# EAGLE design main_board (EAGLE 7.0.0)
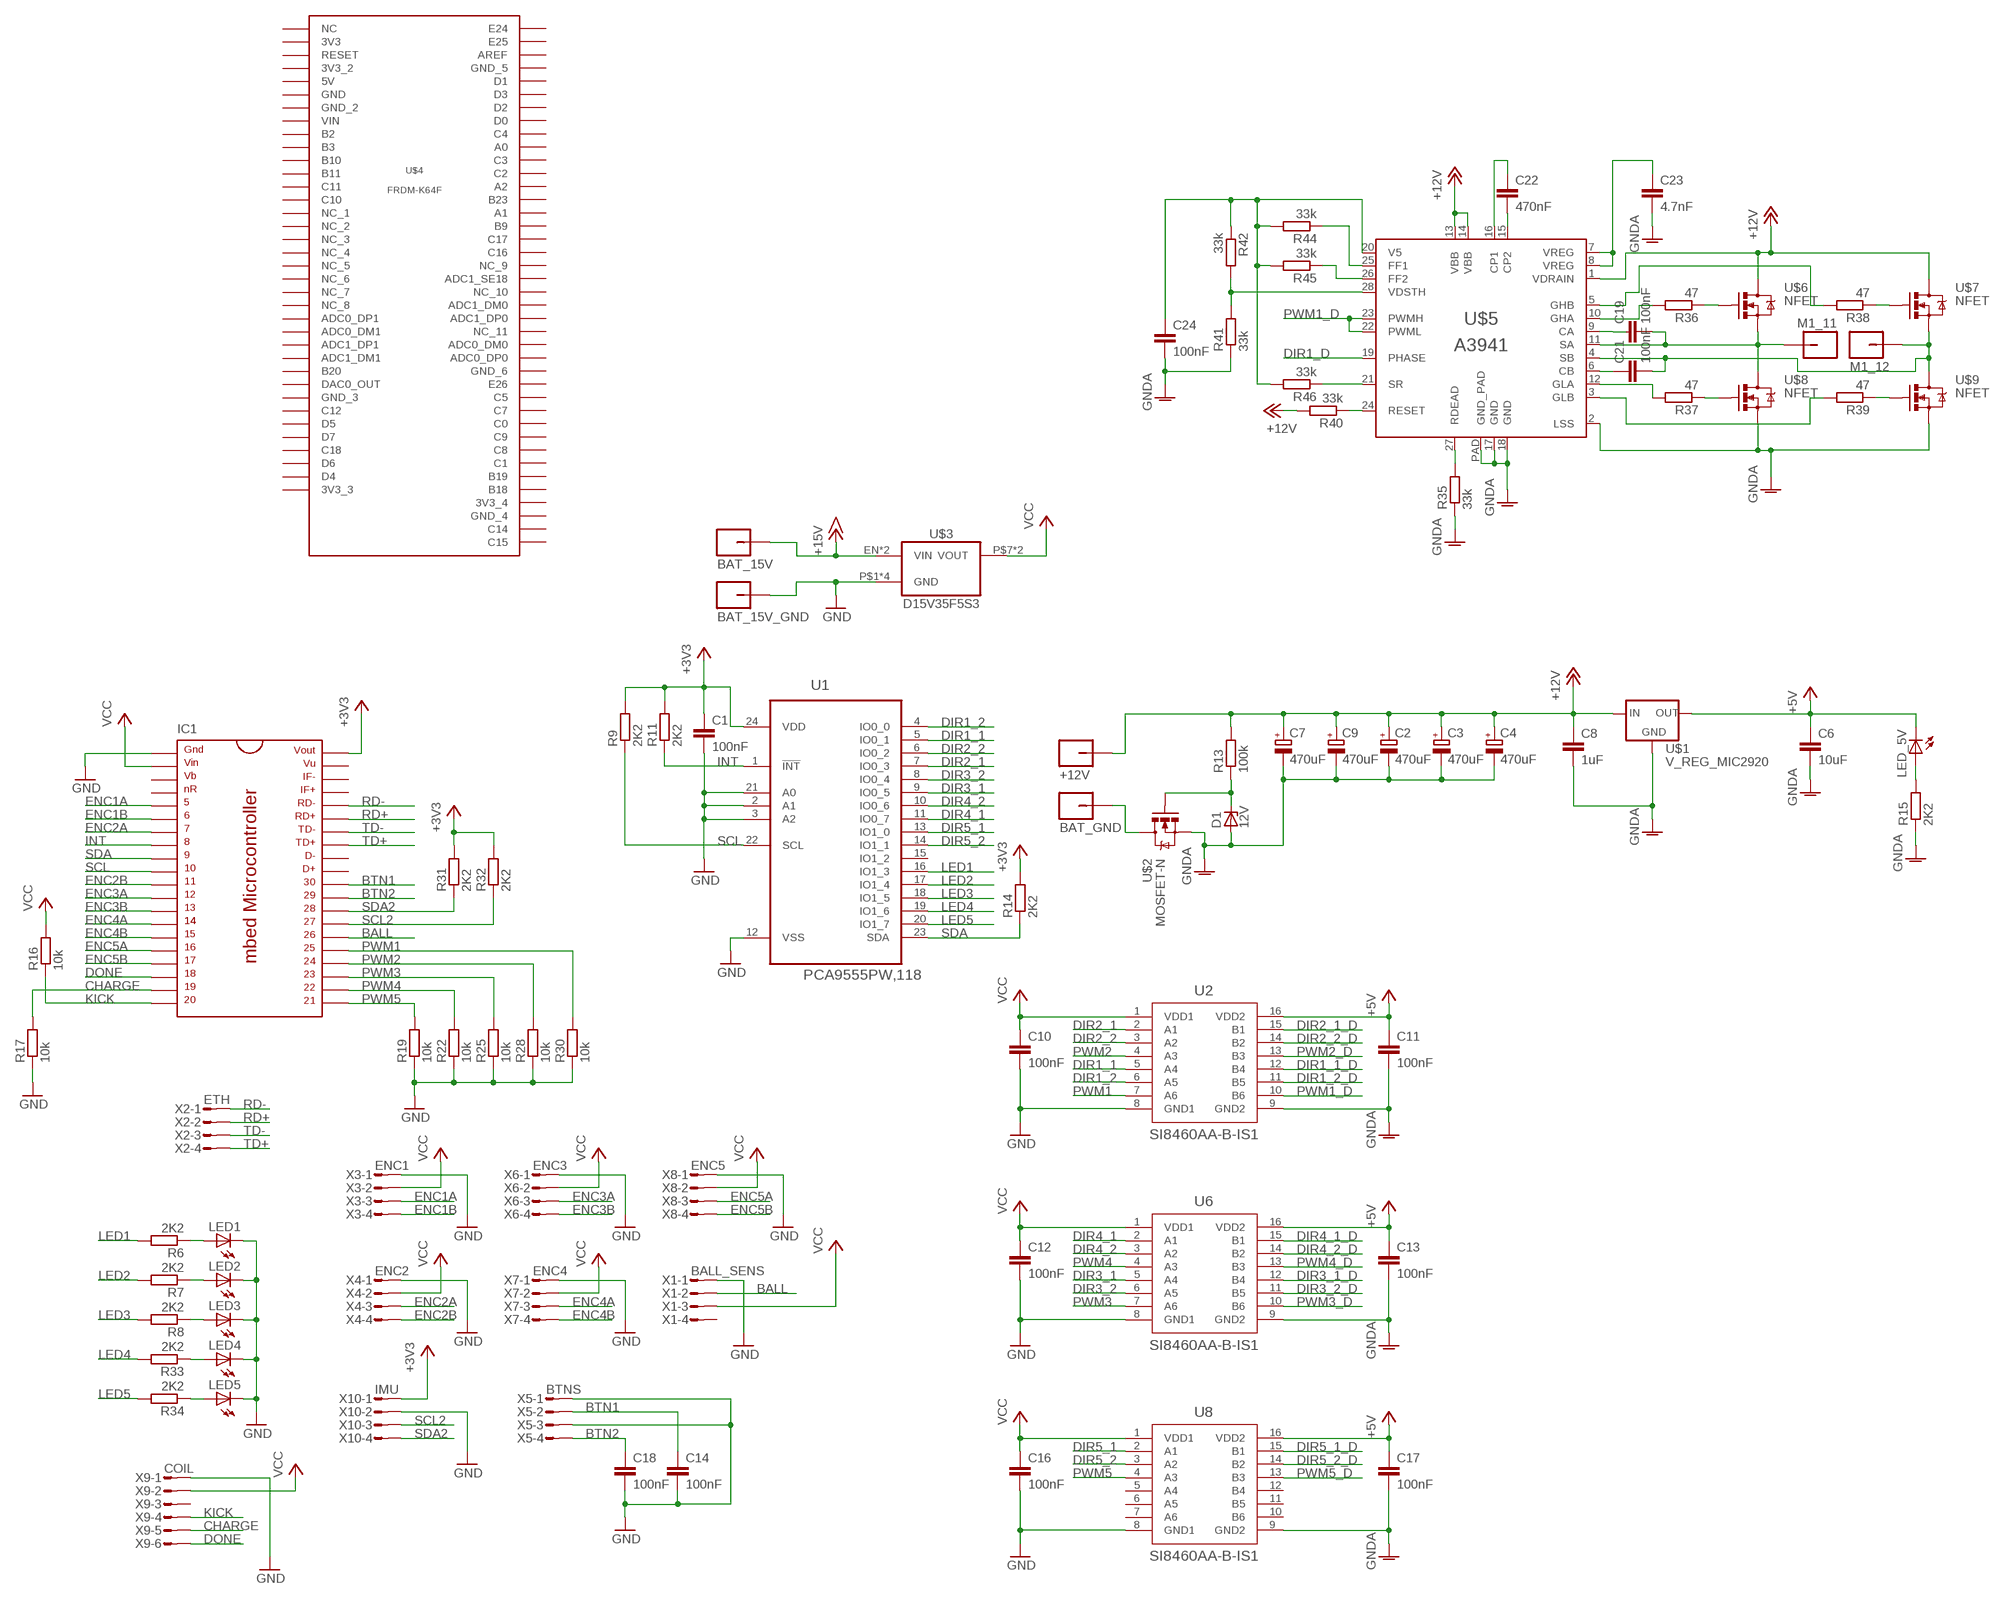
[diagram p0: schematic, sheet 1]

## Parts
+12V  M01_PWR  [PWR_HOLE]
BAT_15V  M01_WIRE  [WIRE_HOLE]
BAT_15V_GND  M01_WIRE  [WIRE_HOLE]
BAT_GND  M01_PWR  [PWR_HOLE]
C1  100nF  C-EUC0603K  [C0603K]
C2  470uF  CPOL-EUE3.5-8  [E3,5-8]
C3  470uF  CPOL-EUE3.5-8  [E3,5-8]
C4  470uF  CPOL-EUE3.5-8  [E3,5-8]
C6  10uF  C-EUC1206K  [C1206K]
C7  470uF  CPOL-EUE3.5-8  [E3,5-8]
C8  1uF  C-EUC0603K  [C0603K]
C9  470uF  CPOL-EUE3.5-8  [E3,5-8]
C10  100nF  C-EUC0603K  [C0603K]
C11  100nF  C-EUC0603K  [C0603K]
C12  100nF  C-EUC0603K  [C0603K]
C13  100nF  C-EUC0603K  [C0603K]
C14  100nF  C-EUC0603K  [C0603K]
C16  100nF  C-EUC0603K  [C0603K]
C17  100nF  C-EUC0603K  [C0603K]
C18  100nF  C-EUC0603K  [C0603K]
C19  100nF  C-EUC0603K  [C0603K]
C21  100nF  C-EUC0603K  [C0603K]
C22  470nF  C-EUC1206K  [C1206K]
C23  4.7nF  C-EUC1206K  [C1206K]
C24  100nF  C-EUC0603K  [C0603K]
D1  12V  ZENER-DIODESOD123  [SOD123]
IC1  MBED_MICROCONTROLLER  [DIL40_0.9]
LED1  LEDCHIP-LED0603  [CHIP-LED0603]
LED2  LEDCHIP-LED0603  [CHIP-LED0603]
LED3  LEDCHIP-LED0603  [CHIP-LED0603]
LED4  LEDCHIP-LED0603  [CHIP-LED0603]
LED5  LEDCHIP-LED0603  [CHIP-LED0603]
LED_5V  LEDCHIP-LED0603  [CHIP-LED0603]
M1_11  M01_WIRE  [WIRE_HOLE]
M1_12  M01_WIRE  [WIRE_HOLE]
R6  2K2  R-EU_R0603  [R0603]
R7  2K2  R-EU_R0603  [R0603]
R8  2K2  R-EU_R0603  [R0603]
R9  2K2  R-EU_R0603  [R0603]
R11  2K2  R-EU_R0603  [R0603]
R13  100k  R-EU_R0603  [R0603]
R14  2K2  R-EU_R0603  [R0603]
R15  2K2  R-EU_R0603  [R0603]
R16  10k  R-EU_R0603  [R0603]
R17  10k  R-EU_R0603  [R0603]
R19  10k  R-EU_R0603  [R0603]
R22  10k  R-EU_R0603  [R0603]
R25  10k  R-EU_R0603  [R0603]
R28  10k  R-EU_R0603  [R0603]
R30  10k  R-EU_R0603  [R0603]
R31  2K2  R-EU_R0603  [R0603]
R32  2K2  R-EU_R0603  [R0603]
R33  2K2  R-EU_R0603  [R0603]
R34  2K2  R-EU_R0603  [R0603]
R35  33k  R-EU_R0603  [R0603]
R36  47  R-EU_R0603  [R0603]
R37  47  R-EU_R0603  [R0603]
R38  47  R-EU_R0603  [R0603]
R39  47  R-EU_R0603  [R0603]
R40  33k  R-EU_R0603  [R0603]
R41  33k  R-EU_R0603  [R0603]
R42  33k  R-EU_R0603  [R0603]
R44  33k  R-EU_R0603  [R0603]
R45  33k  R-EU_R0603  [R0603]
R46  33k  R-EU_R0603  [R0603]
U1  PCA9555PW,118  [SOP65P640X110-24N]
U2  SI8460AA-B-IS1  [SOIC-16]
U6  SI8460AA-B-IS1  [SOIC-16]
U8  SI8460AA-B-IS1  [SOIC-16]
U$1  V_REG_MIC2920  [SOT223]
U$2  MOSFET-N  MOSFET-N-SOT669  [TO127P600X120-5N]
U$3  D15V35F5S3  [D15V35F5S3]
U$4  FRDM-K64F  [FRDM-K64F]
U$5  A3941  [A3941]
U$6  NFET  MOSFET-N-SOT669  [TO127P600X120-5N]
U$7  NFET  MOSFET-N-SOT669  [TO127P600X120-5N]
U$8  NFET  MOSFET-N-SOT669  [TO127P600X120-5N]
U$9  NFET  MOSFET-N-SOT669  [TO127P600X120-5N]
X1  BALL_SENS  MICROMATCH-4  [MICROMATCH-4]
X2  ETH  MICROMATCH-4  [MICROMATCH-4]
X3  ENC1  MICROMATCH-4  [MICROMATCH-4]
X4  ENC2  MICROMATCH-4  [MICROMATCH-4]
X5  BTNS  MICROMATCH-4  [MICROMATCH-4]
X6  ENC3  MICROMATCH-4  [MICROMATCH-4]
X7  ENC4  MICROMATCH-4  [MICROMATCH-4]
X8  ENC5  MICROMATCH-4  [MICROMATCH-4]
X9  COIL  MICROMATCH-6  [MICROMATCH-6]
X10  IMU  MICROMATCH-4  [MICROMATCH-4]

## Nets
+3V3: C1.1 IC1.40 R9.2 R11.2 R14.2 R31.2 R32.2 U1.24(VDD) X10.1
+5V: C6.1 C11.1 C13.1 C17.1 LED_5V.C U2.16(VDD2) U6.16(VDD2) U8.16(VDD2) U$1.3(OUT)
+12V: +12V.P$1 C2.+ C3.+ C4.+ C7.+ C8.1 C9.+ R13.2 R40.2 U$1.1(IN) U$5.1(VDRAIN) U$5.13(VBB) U$5.14(VBB) U$6.5(D) U$7.5(D)
+15V: BAT_15V.P$1 U$3.EN(VIN) U$3.P$5(VIN)
BALL: IC1.26 X1.2
BTN1: C14.1 IC1.30 X5.2
BTN2: C18.1 IC1.29 X5.4
CHARGE: IC1.19 R17.2 X9.5
DIR1_1: U1.5(IO0_1) U2.5(A4)
DIR1_1_D: U2.12(B4)
DIR1_2: U1.4(IO0_0) U2.6(A5)
DIR1_2_D: U2.11(B5)
DIR1_D: U$5.19(PHASE)
DIR2_1: U1.7(IO0_3) U2.2(A1)
DIR2_1_D: U2.15(B1)
DIR2_2: U1.6(IO0_2) U2.3(A2)
DIR2_2_D: U2.14(B2)
DIR3_1: U1.9(IO0_5) U6.5(A4)
DIR3_1_D: U6.12(B4)
DIR3_2: U1.8(IO0_4) U6.6(A5)
DIR3_2_D: U6.11(B5)
DIR4_1: U1.11(IO0_7) U6.2(A1)
DIR4_1_D: U6.15(B1)
DIR4_2: U1.10(IO0_6) U6.3(A2)
DIR4_2_D: U6.14(B2)
DIR5_1: U1.13(IO1_0) U8.2(A1)
DIR5_1_D: U8.15(B1)
DIR5_2: U1.14(IO1_1) U8.3(A2)
DIR5_2_D: U8.14(B2)
DONE: IC1.18 X9.6
ENC1A: IC1.5 X3.3
ENC1B: IC1.6 X3.4
ENC2A: IC1.7 X4.3
ENC2B: IC1.11 X4.4
ENC3A: IC1.12 X6.3
ENC3B: IC1.13 X6.4
ENC4A: IC1.14 X7.3
ENC4B: IC1.15 X7.4
ENC5A: IC1.16 X8.3
ENC5B: IC1.17 X8.4
GND: BAT_15V_GND.P$1 C1.2 C10.2 C12.2 C14.2 C16.2 C18.2 IC1.1 LED1.C LED2.C LED3.C LED4.C LED5.C R17.1 R19.1 R22.1 R25.1 R28.1 R30.1 U1.2(A1) U1.3(A2) U1.12(VSS) U1.21(A0) U2.8(GND1) U6.8(GND1) U8.8(GND1) U$3.P$1(GND) U$3.P$2(GND) U$3.P$3(GND) U$3.P$4(GND) X1.1 X3.1 X4.1 X5.1 X5.3 X6.1 X7.1 X8.1 X9.1 X10.2
GNDA: C2.- C3.- C4.- C6.2 C7.- C8.2 C9.- C11.2 C13.2 C17.2 C23.2 C24.2 D1.A R15.1 R35.1 R41.1 U2.9(GND2) U6.9(GND2) U8.9(GND2) U$1.2(GND) U$1.4(GND) U$2.1(S) U$2.2(S) U$2.3(S) U$5.2(LSS) U$5.17(GND) U$5.18(GND) U$5.PAD(GND_PAD) U$8.1(S) U$8.2(S) U$8.3(S) U$9.1(S) U$9.2(S) U$9.3(S)
INT: IC1.8 R11.1 U1.1(!INT)
KICK: IC1.20 R16.1 X9.4
LED1: R6.2 U1.16(IO1_3)
LED2: R7.2 U1.17(IO1_4)
LED3: R8.2 U1.18(IO1_5)
LED4: R33.2 U1.19(IO1_6)
LED5: R34.2 U1.20(IO1_7)
N$7: LED1.A R6.1
N$8: LED2.A R7.1
N$9: LED3.A R8.1
N$10: LED_5V.A R15.2
N$11: LED4.A R33.1
N$12: LED5.A R34.1
N$13: R37.1 U$8.4(G)
N$14: R38.1 U$7.4(G)
N$16: R39.1 U$9.4(G)
N$17: R36.1 U$6.4(G)
N$19: C21.1 U$5.6(CB)
N$20: D1.C R13.1 U$2.4(G)
N$21: BAT_GND.P$1 U$2.5(D)
N$22: C19.2 M1_11.P$1 U$5.11(SA) U$6.1(S) U$6.2(S) U$6.3(S) U$8.5(D)
N$24: C21.2 M1_12.P$1 U$5.4(SB) U$7.1(S) U$7.2(S) U$7.3(S) U$9.5(D)
N$26: C19.1 U$5.9(CA)
N$27: R35.2 U$5.27(RDEAD)
N$28: R36.2 U$5.10(GHA)
N$29: R38.2 U$5.5(GHB)
N$30: R37.2 U$5.12(GLA)
N$32: R39.2 U$5.3(GLB)
N$37: C22.1 U$5.16(CP1)
N$42: C22.2 U$5.15(CP2)
N$47: C23.1 U$5.7(VREG) U$5.8(VREG)
N$51: R41.2 R42.2 U$5.28(VDSTH)
N$52: C24.1 R42.1 R44.2 R45.2 R46.2 U$5.20(V5)
N$53: R45.1 U$5.26(FF2)
N$54: R40.1 U$5.24(RESET)
N$55: R44.1 U$5.25(FF1)
N$59: R46.1 U$5.21(SR)
PWM1: IC1.25 R30.2 U2.7(A6)
PWM1_D: U2.10(B6) U$5.22(PWML) U$5.23(PWMH)
PWM2: IC1.24 R28.2 U2.4(A3)
PWM2_D: U2.13(B3)
PWM3: IC1.23 R25.2 U6.7(A6)
PWM3_D: U6.10(B6)
PWM4: IC1.22 R22.2 U6.4(A3)
PWM4_D: U6.13(B3)
PWM5: IC1.21 R19.2 U8.4(A3)
PWM5_D: U8.13(B3)
RD+: IC1.35 X2.2
RD-: IC1.36 X2.1
SCL: IC1.10 R9.1 U1.22(SCL)
SCL2: IC1.27 R32.1 X10.3
SDA: IC1.9 R14.1 U1.23(SDA)
SDA2: IC1.28 R31.1 X10.4
TD+: IC1.33 X2.4
TD-: IC1.34 X2.3
VCC: C10.1 C12.1 C16.1 IC1.2 R16.2 U2.1(VDD1) U6.1(VDD1) U8.1(VDD1) U$3.P$7(VOUT) U$3.P$8(VOUT) X1.3 X3.2 X4.2 X6.2 X7.2 X8.2 X9.2
Unconnected: IC1.3 IC1.4 IC1.31 IC1.32 IC1.37 IC1.38 IC1.39 U1.15(IO1_2) U8.5(A4) U8.6(A5) U8.7(A6) U8.10(B6) U8.11(B5) U8.12(B4) U$4.A0 U$4.A1 U$4.A3(A2) U$4.ADC0_DM0 U$4.ADC0_DM1 U$4.ADC0_DP0 U$4.ADC0_DP1 U$4.ADC1_DM0 U$4.ADC1_DM1 U$4.ADC1_DP0 U$4.ADC1_DP1 U$4.ADC1_SE18 U$4.AREF U$4.B2 U$4.B3 U$4.B9 U$4.B10 U$4.B11 U$4.B18 U$4.B19 U$4.B20 U$4.B23 U$4.C0 U$4.C1 U$4.C2 U$4.C3 U$4.C4 U$4.C5 U$4.C7 U$4.C8 U$4.C9 U$4.C10 U$4.C11 U$4.C12 U$4.C14 U$4.C15 U$4.C16 U$4.C17 U$4.C18 U$4.D0 U$4.D1 U$4.D2 U$4.D3 U$4.D4 U$4.D5 U$4.D6 U$4.D7 U$4.DAC0_OUT U$4.E24 U$4.E25 U$4.E26 U$4.NC U$4.NC_1 U$4.NC_2 U$4.NC_3 U$4.NC_4 U$4.NC_5 U$4.NC_6 U$4.NC_7 U$4.NC_8 U$4.NC_9 U$4.NC_10 U$4.NC_11 U$4.RESET X1.4 X9.3

## Power pins joined to a net without a drawn wire
3V3: U$4.3V3
3V3_2: U$4.3V3_2
3V3_3: U$4.3V3_3
3V3_4: U$4.3V3_4
5V: U$4.5V
GND: U$4.GND
GND_2: U$4.GND_2
GND_3: U$4.GND_3
GND_4: U$4.GND_4
GND_5: U$4.GND_5
GND_6: U$4.GND_6
VIN: U$4.VIN

## Library data of the parts
+12V BAT_GND = tellis2:M01_PWR
BAT_15V BAT_15V_GND M1_11 M1_12 = tellis2:M01_WIRE
C1 C6 C8 C10-C14 C16-C19 C21-C24 = rcl:C-EU: CAPACITOR, European symbol
C2-C4 C7 C9 = rcl:CPOL-EU: POLARIZED CAPACITOR, European symbol
D1 = diode:ZENER-DIODE: Z-Diode
IC1 = mbed-microcontroller:MBED_MICROCONTROLLER: mbed Microcontroller, DIP40, 0.9"
LED1-LED5 LED_5V = led:LED: LED OSRAM: - CHIPLED LG R971, LG N971, LY N971, LG Q971, LY Q971, LO R971, LY R971 LH N974, LH R974 LS Q976, LO Q976, LY Q976 LO Q996 - Hyper CHIPLED LW Q18S LB Q993, LB Q99A, LB R99A - SideLED LS A670, LO A670, LY A670, LG A670, LP A670 LB A673, LV A673, LT A673, LW A673 LH A674 LY A675 LS A676, LA A676, LO A676, LY A676, LW A676 LS A679, LY A679, LG A679 - Hyper Micro SIDELED® LS Y876, LA Y876, LO Y876, LY Y876 LT Y87S - SmartLED LW L88C, LW L88S LB L89C, LB L89S, LG L890 LS L89K, LO L89K, LY L89K LS L896, LA L896, LO L896, LY L896 - TOPLED LS T670, LO T670, LY T670, LG T670, LP T670 LSG T670, LSP T670, LSY T670, LOP T670, LYG T670 LG T671, LOG T671, LSG T671 LB T673, LV T673, LT T673, LW T673 LH T674 LS T676, LA T676, LO T676, LY T676, LB T676, LH T676, LSB T676, LW T676 LB T67C, LV T67C, LT T67C, LS T67K, LO T67K, LY T67K, LW E67C LS E67B, LA E67B, LO E67B, LY E67B, LB E67C, LV E67C, LT E67C LW T67C LS T679, LY T679, LG T679 LS T770, LO T770, LY T770, LG T770, LP T770 LB T773, LV T773, LT T773, LW T773 LH T774 LS E675, LA E675, LY E675, LS T675 LS T776, LA T776, LO T776, LY T776, LB T776 LHGB T686 LT T68C, LB T68C - Hyper Mini TOPLED® LB M676 - Mini TOPLED Santana® LG M470 LS M47K, LO M47K, LY M47K Source: http://www.osram.convergy.de LUXEON: - LUMILED® LXK2-PW12-R00, LXK2-PW12-S00, LXK2-PW14-U00, LXK2-PW14-V00 LXK2-PM12-R00, LXK2-PM12-S00, LXK2-PM14-U00 LXK2-PE12-Q00, LXK2-PE12-R00, LXK2-PE12-S00, LXK2-PE14-T00, LXK2-PE14-U00 LXK2-PB12-K00, LXK2-PB12-L00, LXK2-PB12-M00, LXK2-PB14-N00, LXK2-PB14-P00, LXK2-PB14-Q00 LXK2-PR12-L00, LXK2-PR12-M00, LXK2-PR14-Q00, LXK2-PR14-R00 LXK2-PD12-Q00, LXK2-PD12-R00, LXK2-PD12-S00 LXK2-PH12-R00, LXK2-PH12-S00 LXK2-PL12-P00, LXK2-PL12-Q00, LXK2-PL12-R00 Source: www.luxeon.com KINGBRIGHT: KA-3528ASYC Source: www.kingbright.com
R6-R9 R11 R13-R17 R19 R22 R25 R28 R30-R42 R44-R46 = rcl:R-EU_: RESISTOR, European symbol
U1 = PCA9555:PCA9555PW,118: IC, I/O EXPANDER, 16BIT, 24TSSOP; MPN: PCA9555PW,118; OC_FARNELL: 2101299; OC_NEWARK: 70R6680; PACKAGE: 24TSSOP; SUPPLIER: NXP
U2 U6 U8 = si8460:SI8460AA-B-IS1
U$1 = SparkFun-PowerIC:V_REG_MIC2920: MIC2920A (http://www.micrel.com/_PDF/mic2920.pdf) - 400mA output LDO Regulator
U$2 U$6-U$9 = nxp_sot669:MOSFET-N-SOT669
U$3 = D15V35F5S3:D15V35F5S3
U$4 = frdm-k64f:FRDM-K64F
U$5 = a3941:A3941
X1-X8 X10 = con-amp-micromatch:MICROMATCH-4: MicroMaTch 4 7-215464-4 / 0-215464-4 Drawing Number C-215464 DDEController.pdf; MPN: 7-215464-4; OC_FARNELL: 3784629; OC_NEWARK: 19R8124
X9 = con-amp-micromatch:MICROMATCH-6: MicroMaTch 6 7-215464-6 / 0-215464-6 Drawing Number C-215464 DDEController.pdf; MPN: 7-215464-6; OC_FARNELL: 3784630; OC_NEWARK: 19R8125

## Board
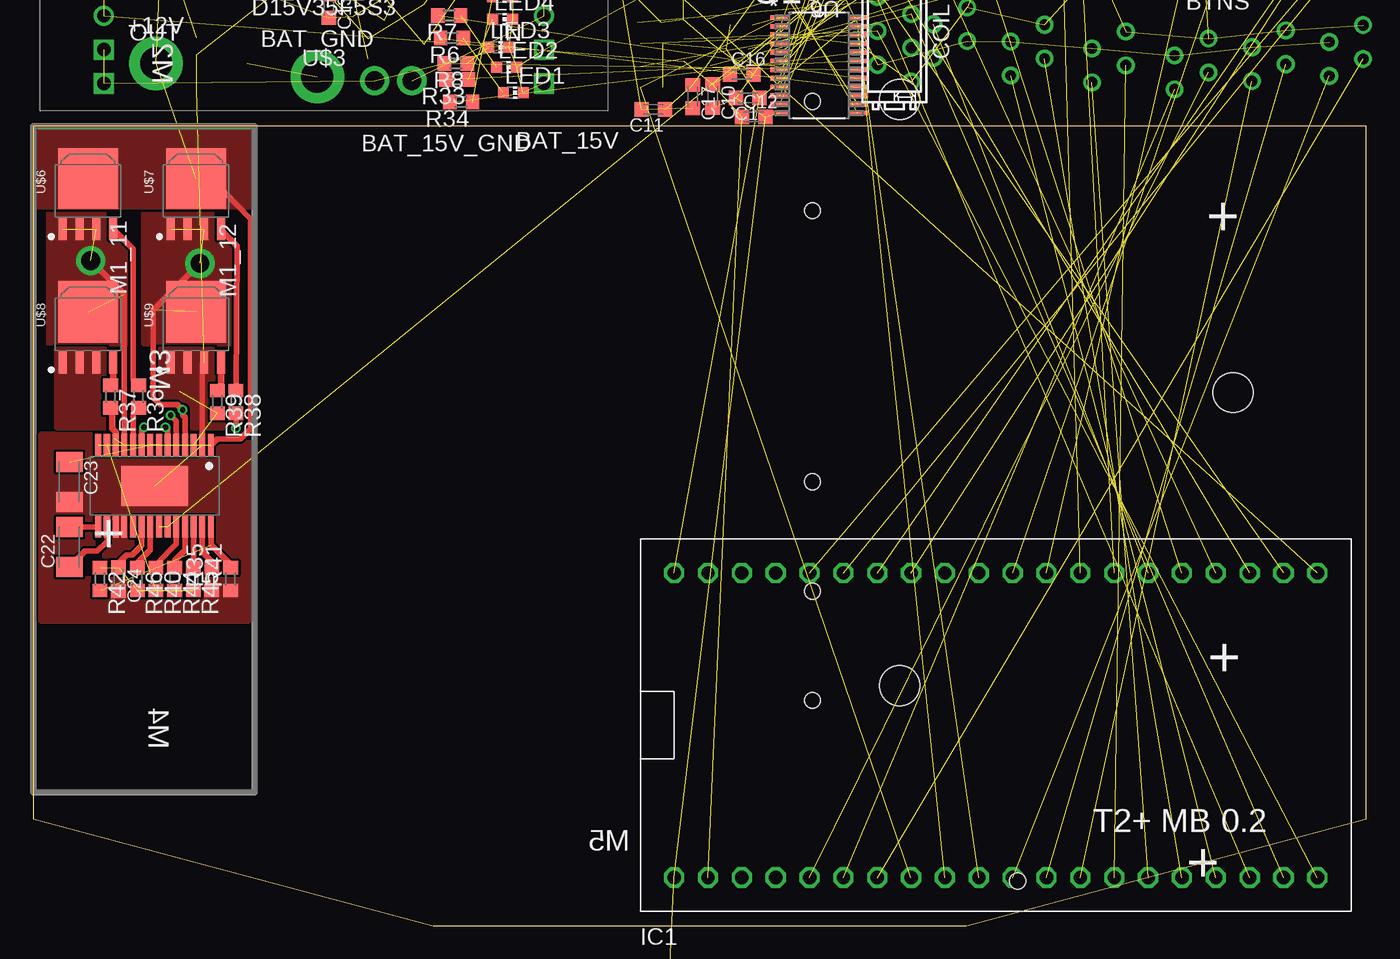
[diagram p1: board, top side]
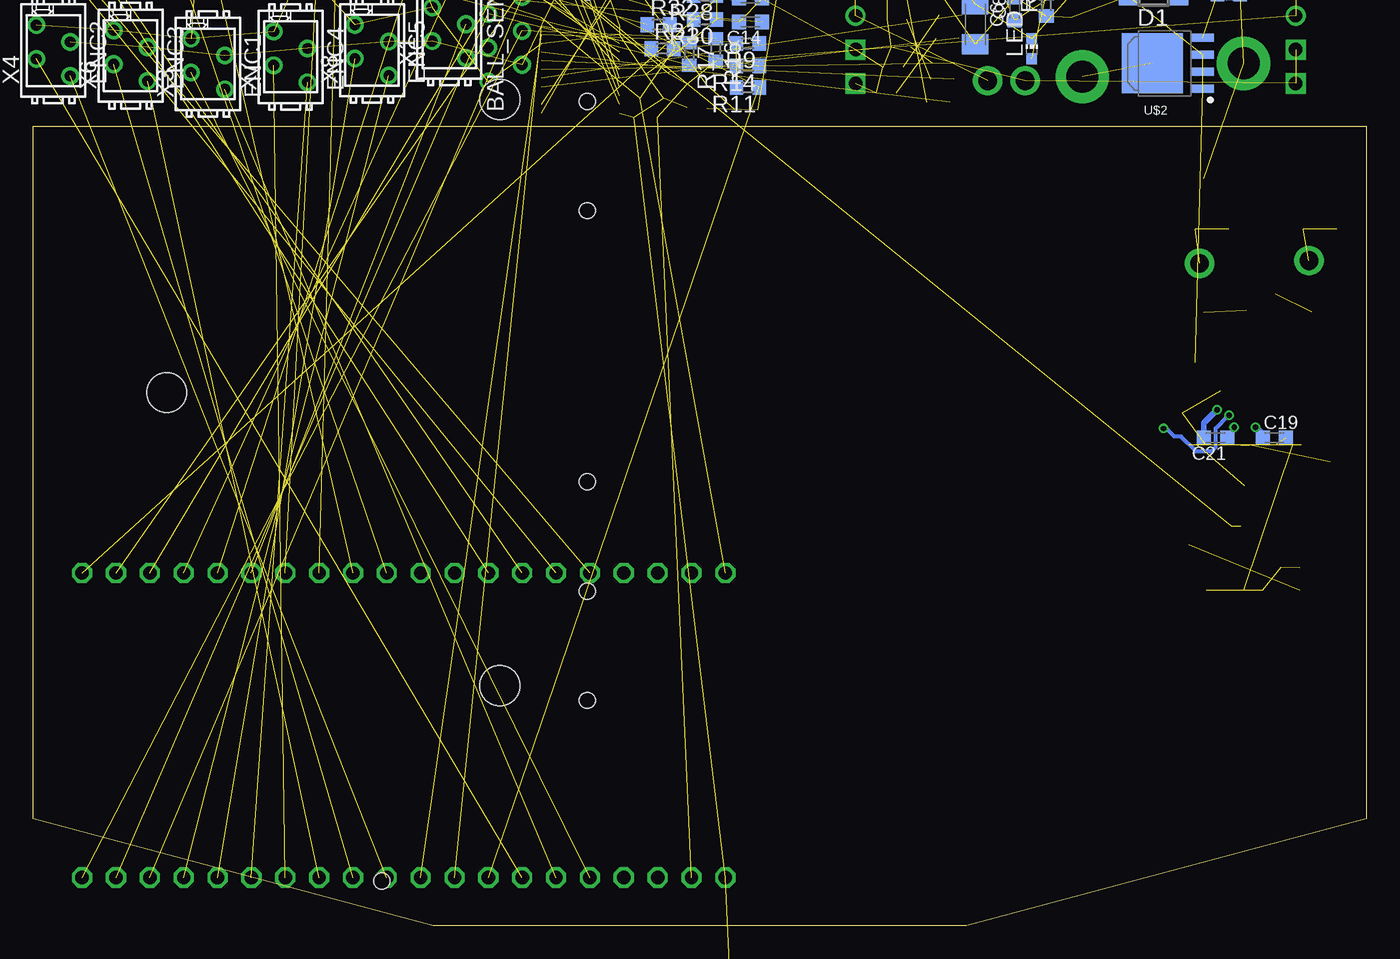
[diagram p2: board, bottom side, seen from below]

Size 100 x 60 mm. Coordinates in mm from the lower left corner, seen from the top.
Outline: 30,0 70,0 100,8 100,60 0,60 0,8 30,0
Copper layers (1*16): Top 0.035mm / dielectric 1.5mm / Bottom 0.035mm
Design rules "Fusion_eagle_rule_v1.1 *": minimum track width 6mil, minimum drill 12mil, track to track 0.2mm, track to pad 0.2mm, pad to pad 0.2mm, via to via 0.2mm, smd to smd 0mil, copper to edge 10mil, drill to drill 10mil, minimum pad ring 10mil, minimum via ring 6mil, stop-mask expansion 2mil, vias tented up to drill 100mil, thermal gap 10mil
Holes 1.2 mm at 58.45,33.3 58.45,25.1 58.45,16.9 58.45,53.65 58.45,61.85 58.45,70.05 80.5,75.85 88.7,75.85 96.9,75.85 73.85,3.35
Holes 3 mm at 65,62 65,18 90,40

### Footprints (pad centres in the part's own frame; a part is rotated, then mirrored left to right if it is on the bottom)
PWR_HOLE = drill 2.4 pad 4: P$1 0,0
WIRE_HOLE = drill 1.4 pad 2.2: P$1 0,0
C0603K = smd 1.05 x 1.08: 1 -0.875,0; 2 0.875,0
E3,5-8 = drill 0.813 pad 1.6: + -1.778,0 | drill 0.813 pad 1.6 octagon: - 1.778,0
C1206K = smd 1.5 x 2: 1 -1.5,0; 2 1.5,0
SOD123 = smd 1.4 x 1.4: A 1.9,0; C -1.9,0
DIL40_0.9 = drill 1 pad 1.397 octagon: 1 -22.86,-11.43; 2 -20.32,-11.43; 3 -17.78,-11.43; 4 -15.24,-11.43; 5 -12.7,-11.43; 6 -10.16,-11.43; 7 -7.62,-11.43; 8 -5.08,-11.43; 9 -2.54,-11.43; 10 0,-11.43; 11 2.54,-11.43; 12 5.08,-11.43; 13 7.62,-11.43; 14 10.16,-11.43; 15 12.7,-11.43; 16 15.24,-11.43; 17 17.78,-11.43; 18 20.32,-11.43; 19 22.86,-11.43; 20 25.4,-11.43; 21 25.4,11.43; 22 22.86,11.43; 23 20.32,11.43; 24 17.78,11.43; 25 15.24,11.43; 26 12.7,11.43; 27 10.16,11.43; 28 7.62,11.43; 29 5.08,11.43; 30 2.54,11.43; 31 0,11.43; 32 -2.54,11.43; 33 -5.08,11.43; 34 -7.62,11.43; 35 -10.16,11.43; 36 -12.7,11.43; 37 -15.24,11.43; 38 -17.78,11.43; 39 -20.32,11.43; 40 -22.86,11.43
CHIP-LED0603 = smd 0.8 x 0.8: A 0,-0.75; C 0,0.75
R0603 = smd 1 x 1.1: 1 -0.85,0; 2 0.85,0
SOP65P640X110-24N = smd 1.473 x 0.356: 1 -2.921,3.581; 2 -2.921,2.921; 3 -2.921,2.286; 4 -2.921,1.626; 5 -2.921,0.965; 6 -2.921,0.33; 7 -2.921,-0.33; 8 -2.921,-0.965; 9 -2.921,-1.626; 10 -2.921,-2.286; 11 -2.921,-2.921; 12 -2.921,-3.581; 13 2.921,-3.581; 14 2.921,-2.921; 15 2.921,-2.286; 16 2.921,-1.626; 17 2.921,-0.965; 18 2.921,-0.33; 19 2.921,0.33; 20 2.921,0.965; 21 2.921,1.626; 22 2.921,2.286; 23 2.921,2.921; 24 2.921,3.581
SOIC-16 = smd 1.549 x 0.61: 1 -2.692,4.445; 2 -2.692,3.175; 3 -2.692,1.905; 4 -2.692,0.635; 5 -2.692,-0.635; 6 -2.692,-1.905; 7 -2.692,-3.175; 8 -2.692,-4.445; 9 2.692,-4.445; 10 2.692,-3.175; 11 2.692,-1.905; 12 2.692,-0.635; 13 2.692,0.635; 14 2.692,1.905; 15 2.692,3.175; 16 2.692,4.445
SOT223 = smd 1.219 x 2.235: 1 -2.311,-3.099; 2 0,-3.099; 3 2.311,-3.099 | smd 3.6 x 2.2: 4 0,3.099
TO127P600X120-5N = smd 1.65 x 0.6: 1 -2.65,1.905; 2 -2.65,0.635; 3 -2.65,-0.635; 4 -2.65,-1.905 | smd 4.6 x 4.5: 5 1.15,0
D15V35F5S3 = drill 1: EN -16.51,-3.81; P$5 -16.51,-1.27; P$7 16.51,-1.27; P$8 16.51,-3.81 | drill 1 square: P$1 -16.51,3.81; P$2 -16.51,1.27; P$3 16.51,3.81; P$4 16.51,1.27
FRDM-K64F = drill 1: 3V3 15.494,-0.241; 3V3_2 20.574,-0.241; 3V3_3 54.884,39.926; 3V3_4 57.932,29.766; 5V 23.114,-0.241; A0 26.784,48.006; A1 40.945,48.006; A3 35.865,48.006; ADC0_DM0 19.164,45.466; ADC0_DM1 38.43,2.299; ADC0_DP0 21.704,45.466; ADC0_DP1 35.89,2.299; ADC1_DM0 11.544,45.466; ADC1_DM1 43.51,2.299; ADC1_DP0 14.084,45.466; ADC1_DP1 40.97,2.299; ADC1_SE18 6.464,45.466; AREF 9.004,48.006; B2 35.89,-0.241; B3 38.43,-0.241; B9 43.485,48.006; B10 40.97,-0.241; B11 43.51,-0.241; B18 48.565,45.466; B19 46.025,45.466; B20 46.05,2.299; B23 38.405,48.006; C0 35.865,45.466; C1 43.485,45.466; C2 33.325,48.006; C3 30.785,48.006; C4 24.244,48.006; C5 30.785,45.466; C7 33.325,45.466; C8 40.945,45.466; C9 38.405,45.466; C10 48.59,-0.241; C11 46.05,-0.241; C12 52.344,37.386; C14 57.932,34.846; C15 57.932,37.386; C16 48.565,48.006; C17 46.025,48.006; C18 54.884,32.306; D0 21.704,48.006; D1 14.084,48.006; D2 19.164,48.006; D3 16.624,48.006; D4 54.884,37.386; D5 52.344,34.846; D6 54.884,34.846; D7 52.344,32.306; DAC0_OUT 48.59,2.299; E24 3.924,48.006; E25 6.464,48.006; E26 26.784,45.466; GND 25.654,-0.241; GND_2 28.194,-0.241; GND_3 52.344,39.926; GND_4 57.932,32.306; GND_5 11.544,48.006; GND_6 24.244,45.466; NC 12.954,-0.241; NC_1 12.954,2.299; NC_2 15.494,2.299; NC_3 18.034,2.299; NC_4 20.574,2.299; NC_5 23.114,2.299; NC_6 25.654,2.299; NC_7 28.194,2.299; NC_8 30.734,2.299; NC_9 3.924,45.466; NC_10 9.004,45.466; NC_11 16.624,45.466; RESET 18.034,-0.241; VIN 30.734,-0.241
A3941 = smd 1.65 x 0.45: 1 -3.05,4.225; 2 -3.05,3.575; 3 -3.05,2.925; 4 -3.05,2.275; 5 -3.05,1.625; 6 -3.05,0.975; 7 -3.05,0.325; 8 -3.05,-0.325; 9 -3.05,-0.975; 10 -3.05,-1.625; 11 -3.05,-2.275; 12 -3.05,-2.925; 13 -3.05,-3.575; 14 -3.05,-4.225; 15 3.05,-4.225; 16 3.05,-3.575; 17 3.05,-2.925; 18 3.05,-2.275; 19 3.05,-1.625; 20 3.05,-0.975; 21 3.05,-0.325; 22 3.05,0.325; 23 3.05,0.975; 24 3.05,1.625; 25 3.05,2.275; 26 3.05,2.925; 27 3.05,3.575; 28 3.05,4.225 | smd 3 x 5: PAD 0,0
MICROMATCH-4 = drill 0.813: 1 1.905,1.27; 2 0.635,-1.27; 3 -0.635,1.27; 4 -1.905,-1.27
MICROMATCH-6 = drill 0.813: 1 3.175,1.27; 2 1.905,-1.27; 3 0.635,1.27; 4 -0.635,-1.27; 5 -1.905,1.27; 6 -3.175,-1.27

### Placement (x,y rotation side)
+12V  9.2,64.7 0 top  (outside the outline)
BAT_15V  28.4,63.4 0 top  (outside the outline)
BAT_15V_GND  25.6,63.4 0 top  (outside the outline)
BAT_GND  21.3,63.7 0 top  (outside the outline)
C1  53.6,62.1 180 top
C2  12.2,76.3 180 bottom  (outside the outline)
C3  20.5,77.2 180 bottom  (outside the outline)
C4  8.1,76.5 270 bottom  (outside the outline)
C6  29.33,67.63 270 bottom  (outside the outline)
C7  3.7,75.8 180 bottom  (outside the outline)
C8  26.37,68.79 90 bottom  (outside the outline)
C9  16.6,76 90 bottom  (outside the outline)
C10  50.97,62.25 270 top
C11  46.5,61.23 180 top
C12  54.05,60.67 0 top
C13  22.17,69 270 top  (outside the outline)
C14  46.2,67.8 180 bottom  (outside the outline)
C16  53.15,63.87 0 top  (outside the outline)
C17  49.47,62.2 270 top
C18  46.2,69.6 0 bottom  (outside the outline)
C19  6.9,36.6 0 bottom
C21  11.3,36.6 180 bottom
C22  2.7,28.4 90 top
C23  2.7,33.3 270 top
C24  6.4,26 270 top
D1  15.95,69.76 180 bottom  (outside the outline)
IC1  70.94,15.03 0 top
LED1  36,62.5 270 top
LED2  35.5,64.4 270 top  (outside the outline)
LED3  34.9,65.9 270 top  (outside the outline)
LED4  35.2,68 270 top  (outside the outline)
LED5  35.2,69.7 270 top  (outside the outline)
LED_5V  25.1,65.8 0 bottom  (outside the outline)
M1_11  4.3,49.9 270 top
M1_12  12.5,49.7 270 top
R6  31.4,66.6 180 top  (outside the outline)
R7  31.2,68.3 180 top  (outside the outline)
R8  31.7,64.7 180 top  (outside the outline)
R9  46.4,66.2 180 bottom  (outside the outline)
R11  46.4,62.9 180 bottom
R13  10.31,69.89 0 bottom  (outside the outline)
R14  46.4,64.5 180 bottom  (outside the outline)
R15  24,69.1 90 bottom  (outside the outline)
R16  48.8,65.7 270 bottom  (outside the outline)
R17  50.8,65.4 270 bottom  (outside the outline)
R19  46,71.3 180 bottom  (outside the outline)
R22  45.7,72.7 180 bottom  (outside the outline)
R25  49.5,71.9 180 bottom  (outside the outline)
R28  49.6,69.8 180 bottom  (outside the outline)
R30  49.6,68 180 bottom  (outside the outline)
R31  52.8,65.8 0 bottom  (outside the outline)
R32  53.1,67.6 0 bottom  (outside the outline)
R33  31.8,63.5 180 top  (outside the outline)
R34  32.1,61.8 180 top
R35  13.4,26 90 top
R36  7.9,39.7 270 top
R37  5.8,39.7 270 top
R38  15.2,39.3 270 top
R39  13.8,39.3 270 top
R40  9.2,26 270 top
R41  14.8,26 90 top
R42  5,26 270 top
R44  10.6,26 270 top
R45  12,26 270 top
R46  7.8,26 270 top
U1  58.95,64.55 0 top
U2  67.64,76.68 90 top  (outside the outline)
U6  57.66,75.14 180 top  (outside the outline)
U8  47.81,77.33 270 top  (outside the outline)
U$1  33.2,74.9 180 bottom  (outside the outline)
U$2  14.9,64.7 180 bottom
U$3  21.8,67 180 top  (outside the outline)
U$4  19.8,-53.4 0 top  (outside the outline)
U$5  9.1,33 270 top
U$6  4.1,54.9 90 top
U$7  12.2,54.9 90 top
U$8  4.1,44.9 90 top
U$9  12.2,44.9 90 top
X1  68.8,67 90 bottom  (outside the outline)
X2  96.9,72.9 0 top  (outside the outline)
X3  86.9,64.65 90 bottom
X4  98.5,65.66 90 bottom  (outside the outline)
X5  88.3,73 0 top  (outside the outline)
X6  92.7,65.27 90 bottom  (outside the outline)
X7  80.7,65.18 90 bottom  (outside the outline)
X8  74.6,65.69 90 bottom  (outside the outline)
X9  64.6,66.5 270 top  (outside the outline)
X10  79.2,73.2 0 top  (outside the outline)

### Tracks (layer width: path | path; a pad name or v marks a point on that pad's centre or on a via)
+3V3  (8 unrouted)
+5V  (8 unrouted)
+12V  (12 unrouted)
  Top 0.4: U$7.5 13.4,56 16.3,53 16.3,37.3 15.5,36.5 13.78,36.5 U$5.1
  pour Top (isolate 0.2, no thermals): 0.3,59.7 16.3,59.7 16.3,54 0.3,54
+15V  (2 unrouted)
BALL  (1 unrouted)
BTN1  (2 unrouted)
BTN2  (2 unrouted)
CHARGE  (2 unrouted)
DIR1_1  (1 unrouted)
DIR1_2  (1 unrouted)
DIR2_1  (1 unrouted)
DIR2_2  (1 unrouted)
DIR3_1  (1 unrouted)
DIR3_2  (1 unrouted)
DIR4_1  (1 unrouted)
DIR4_2  (1 unrouted)
DIR5_1  (1 unrouted)
DIR5_2  (1 unrouted)
DONE  (1 unrouted)
ENC1A  (1 unrouted)
ENC1B  (1 unrouted)
ENC2A  (1 unrouted)
ENC2B  (1 unrouted)
ENC3A  (1 unrouted)
ENC3B  (1 unrouted)
ENC4A  (1 unrouted)
ENC4B  (1 unrouted)
ENC5A  (1 unrouted)
ENC5B  (1 unrouted)
GND  (40 unrouted)
GNDA  (21 unrouted)
  Top 0.4: U$5.2 12.68,42.08 12.7,42.1 12.7,42.12 U$9.3
  pour Top (isolate 0.2, no thermals): 14.2,43.2 14.2,37.4 1.8,37.4 1.8,43.2
  pour Top (isolate 0.2, no thermals): 0.6,36.8 16.1,36.8 16.1,22.9 0.6,22.9
INT  (2 unrouted)
KICK  (2 unrouted)
LED1  (1 unrouted)
LED2  (1 unrouted)
LED3  (1 unrouted)
LED4  (1 unrouted)
LED5  (1 unrouted)
N$7  (1 unrouted)
N$8  (1 unrouted)
N$9  (1 unrouted)
N$10  (1 unrouted)
N$11  (1 unrouted)
N$12  (1 unrouted)
N$13
  Top 0.5: U$8.4 6,40.84 R37.1
N$14
  Top 0.4: R38.1 15.3,51 14.11,52.2 U$7.4
N$16
  Top 0.5: U$9.4 14.11,40.26 R39.1
N$17
  Top 0.4: R36.1 7.5,40.95 7.5,50.76 U$6.4
N$19  (via drill 0.4)
  Top 0.4: U$5.6 10.07,37.23 v9.9,37.4
  Bottom 0.4: v9.9,37.4 9.82,37.33 C21.1
N$20  (2 unrouted)
N$21  (1 unrouted)
N$22  (5 unrouted)
  Top 0.4: U$5.11 6.83,47.38 M1_11.P$1
  pour Top (isolate 0.2, rank 2, no thermals): 1.2,53.5 1.2,43.7 7.6,43.7 7.6,53.5
N$24  (via drill 0.4)  (4 unrouted)
  Top 0.4: U$5.4 11.38,38.12 11.2,38.3 v11.2,38.7 10.8,39.1 9.5,39.1 9,39.6 9,46.2 M1_12.P$1
  Bottom 0.4: C21.2 12.18,37.73 v11.2,38.7
  pour Top (isolate 0.2, rank 2, no thermals): 8.3,53.5 8.3,43.7 15.6,43.7 15.6,53.5
N$26  (via drill 0.4)
  Top 0.4: v8.3,37.4 8.12,37.23 U$5.9
  Bottom 0.4: C19.1 7.78,36.88 v8.3,37.4
N$27
  Top 0.4: U$5.27 12.68,28.02 13.4,27.3 R35.2
N$28
  Top 0.4: U$5.10 7.47,38.42 R36.2
N$29  (via drill 0.4)
  Top 0.4: v15.2,37.3 R38.2 | U$5.5 10.72,37.88 v10.3,38.3
  Bottom 0.3: v10.3,38.3 11.3,37.3 11.3,35.9 11.6,35.6 12.8,35.6 13.9,36.7 14.4,36.7 15,37.3 v15.2,37.3
N$30
  Top 0.5: U$5.12 6.17,37.02 5.9,37.3 5.9,38.45 R37.2
N$32  (2 unrouted)
N$37
  Top 0.4: U$5.16 5.53,28.82 4.8,28.1 3.9,28.1 C22.1
N$42
  Top 0.4: U$5.15 4.88,29.9 C22.2
N$47  (2 unrouted)
N$51  (1 unrouted)
  Top 0.4: U$5.28 13.32,28.57 14.7,27.2 14.7,26.95 R41.2
N$52  (4 unrouted)
  Top 0.4: U$5.20 8.12,28.52 7.4,27.8 7,27.8 6.4,27.2 C24.1
N$53
  Top 0.4: U$5.26 12.03,26.88 R45.1
N$54
  Top 0.4: U$5.24 10.72,28.62 9.2,27.1 R40.1
N$55
  Top 0.4: U$5.25 11.38,28.18 10.6,27.4 R44.1
N$59
  Top 0.4: U$5.21 8.78,28.18 7.8,27.2 R46.1
PWM1  (2 unrouted)
PWM1_D  (2 unrouted)
PWM2  (2 unrouted)
PWM3  (2 unrouted)
PWM4  (2 unrouted)
PWM5  (2 unrouted)
RD+  (1 unrouted)
RD-  (1 unrouted)
SCL  (2 unrouted)
SCL2  (2 unrouted)
SDA  (2 unrouted)
SDA2  (2 unrouted)
TD+  (1 unrouted)
TD-  (1 unrouted)
VCC  (16 unrouted)

### Text on the board
tNames: M1 | M2 | + | M3 | + | + | M4 | T2+ MB 0.2 | M5 | +